# Altium schematic sheet SerialConverter.SchDoc
size A; SheetNumber: 3; SheetTotal: 6
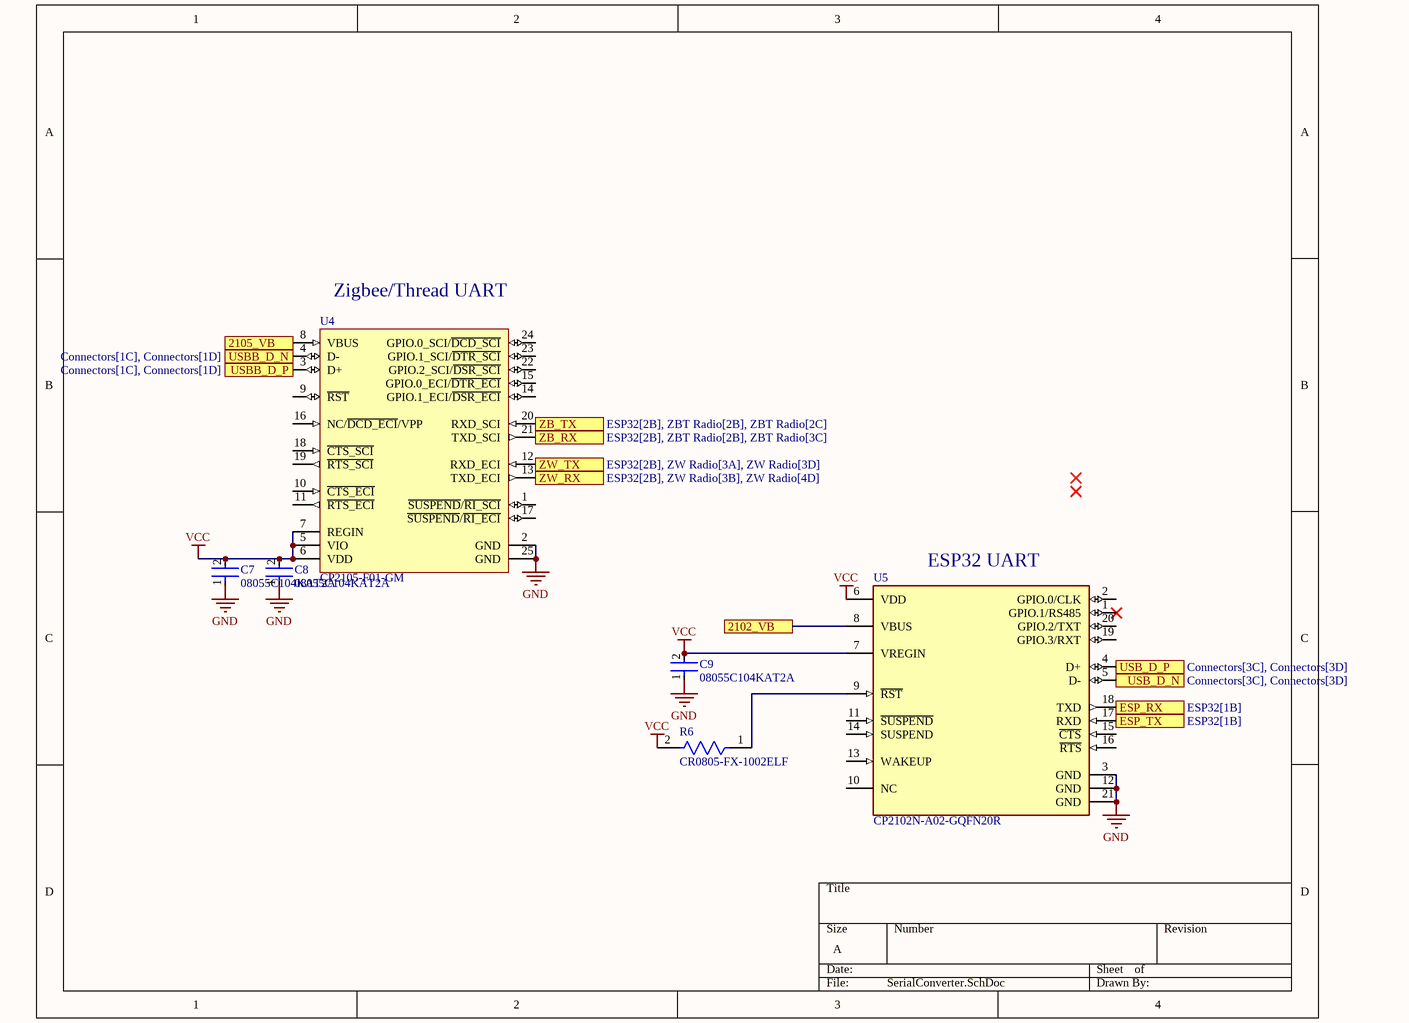
[diagram p0: SerialConverter.SchDoc]

## Parts
C7  08055C104KAT2A  [FP-0805-L_2_01_0_2-W_1_25-IPC_C]
C8  08055C104KAT2A  [FP-0805-L_2_01_0_2-W_1_25-IPC_C]
C9  08055C104KAT2A  [FP-0805-L_2_01_0_2-W_1_25-IPC_C]
R6  CR0805-FX-1002ELF  [FP-CR0805-IPC_A]
U4  CP2105-F01-GM  [SLAB-QFN-24-2675x2675TP_N]
U5  CP2102N-A02-GQFN20R  [FP-CP2102N-A02-GQFN20R-MFG]

## Ports
2102_VB, 2105_VB, ESP_RX (out, see ESP32[1B]), ESP_TX (in, see ESP32[1B]), USB_D_N (see Connectors[3C], Connectors[3D]), USB_D_P (see Connectors[3C], Connectors[3D]), USBB_D_N (see Connectors[1C], Connectors[1D]), USBB_D_P (see Connectors[1C], Connectors[1D]), ZB_RX (out, see ESP32[2B], ZBT Radio[2B], ZBT Radio[3C]), ZB_TX (in, see ESP32[2B], ZBT Radio[2B], ZBT Radio[2C]), ZW_RX (out, see ESP32[2B], ZW Radio[3B], ZW Radio[4D]), ZW_TX (in, see ESP32[2B], ZW Radio[3A], ZW Radio[3D])

## Nets
GND: C7.1 C8.1 C9.1 U4.2(GND) U4.25(GND) U5.3(GND) U5.12(GND) U5.21(GND)
VCC: C7.2 C8.2 C9.2 R6.2 U4.5(VIO) U4.6(VDD) U4.7(REGIN) U5.6(VDD) U5.7(VREGIN)
2102_VB: U5.8(VBUS) ; port 2102_VB
2105_VB: U4.8(VBUS) ; port 2105_VB
ESP_RX: U5.18(TXD) ; port ESP_RX
ESP_TX: U5.17(RXD) ; port ESP_TX
USB_D_N: U5.5(D-) ; port USB_D_N
USB_D_P: U5.4(D+) ; port USB_D_P
USBB_D_N: U4.4(D-) ; port USBB_D_N
USBB_D_P: U4.3(D+) ; port USBB_D_P
ZB_RX: U4.21(TXD_SCI) ; port ZB_RX
ZB_TX: U4.20(RXD_SCI) ; port ZB_TX
ZW_RX: U4.13(TXD_ECI) ; port ZW_RX
ZW_TX: U4.12(RXD_ECI) ; port ZW_TX
NetR6_1: R6.1 U5.9(~{RST})

Not connected (* = marked no-connect by the designer): U4 1(~{SUSPEND}/~{RI_SCI}) 9(~{RST}) 10(~{CTS_ECI}) 11(~{RTS_ECI}) 14(GPIO.1_ECI/~{DSR_ECI}) 15(GPIO.0_ECI/~{DTR_ECI}) 16(NC/~{DCD_ECI}/VPP) 17(~{SUSPEND}/~{RI_ECI}) 18(~{CTS_SCI}) 19(~{RTS_SCI}) 22(GPIO.2_SCI/~{DSR_SCI}) 23(GPIO.1_SCI/~{DTR_SCI}) 24(GPIO.0_SCI/~{DCD_SCI}); U5 1(GPIO.1/RS485)* 2(GPIO.0/CLK) 10(NC) 11(~{SUSPEND}) 13(WAKEUP) 14(SUSPEND) 15(~{CTS}) 16(~{RTS}) 19(GPIO.3/RXT) 20(GPIO.2/TXT)

## Notes on the sheet
- (near U4) Zigbee/Thread UART
- (near U5) ESP32 UART

## Library data of the parts
C7-C9 = CMP-2000-05016-2: General Purpose Ceramic Capacitor, 0805, 100nF, 10%, X7R, 0.15, 50V; Dissipation Factor: 2.5%; Insulation Resistance: 100GR; Voltage Rating (DC): 50V; Package Quantity: 4000; Tolerance: 10%; Voltage Rating: 50V; Dielectric: X7R; Case/Package: 0805; Lead Free: Lead Free; Dielectric Material: Ceramic; Thickness: 0.037inch; Weight: 0.001411oz; Max Operating Temperature: 125°C; REACH SVHC: No SVHC; Mount: Surface Mount; RoHS Compliant: Yes; Depth: 1.25mm; Height: 0.5mm; Case Code (Metric): 2012; Length: 2mm; Termination: Standard; Case Code (Imperial): 0805; Number of Pins: 2; Voltage: 50V; Radiation Hardening: No; Min Operating Temperature: -55°C; Capacitance: 100nF; Width: 1.2mm; Series: MLCC X7R; Packaging: Cut Tape
R6 = CMP-07231-003204-1: Thick Film Chip Resistors 0805 10kΩ 0.125W 1% 100ppm/°C; Max Power Dissipation: 125mW; Voltage Rating: 150V; Voltage Rating (DC): 100V; Resistance: 10kR; Height: 0.5mm; Tolerance: 1%; Max Operating Temperature: 155°C; Thickness: 508um; Radiation Hardening: No; Packaging: Tape and Reel; Depth: 1.25mm; Contact Plating: Tin; Package Quantity: 1; Case Code (Metric): 2012; REACH SVHC: No SVHC; Min Operating Temperature: -55°C; Power Rating: 125mW; Mount: Surface Mount; Length: 2mm; Case Code (Imperial): 0805; Width: 1.25mm; Temperature Coefficient: 100ppm/°C; Termination: SMD/SMT; Composition: Thick Film; Features: Moisture Resistant; Case/Package: 0805; Number of Terminations: 2
U4 = CMP-0511-00003-1: Single-Chip USB to Dual UART Bridge, 5 Dig I/O Pins, Internal Oscillator, 296 Bytes EEPROM, -40 to 85 degC, 24-pin QFN; Manufacturer: Silicon Labs; Internal Oscillator: TRUE; Sub-Family: USB Bridges; ComponentLink3URL: http://www.silabs.com/Support%20Documents/TechnicalDocs/C8051F93x-92x.pdf; PartNumber: CP2105-F01-GM; PackageDescription: 24-Pin Quad-Flat No-Leads Package, Body 4 x 4 mm, Pitch 0.5 mm; Code_JEDEC: MO-220; ComponentLink2URL: http://www.silabs.com/Support%20Documents/TechnicalDocs/CP2105.pdf; Mounting Technology: Surface Mount; ComponentLink1URL: http://www.silabs.com/; ComponentLink1Description: Manufacturer URL; EEPROM: 296 Bytes; ComponentLink2Description: Datasheet; ComponentLink3Description: Package Specification; Code_IPC: J-STD-020; DatasheetVersion: Rev. 1.0; PackageReference: QFN-24
U5 = CMP-08107-000007-1: IC USB TO UART BRIDGE QFN20